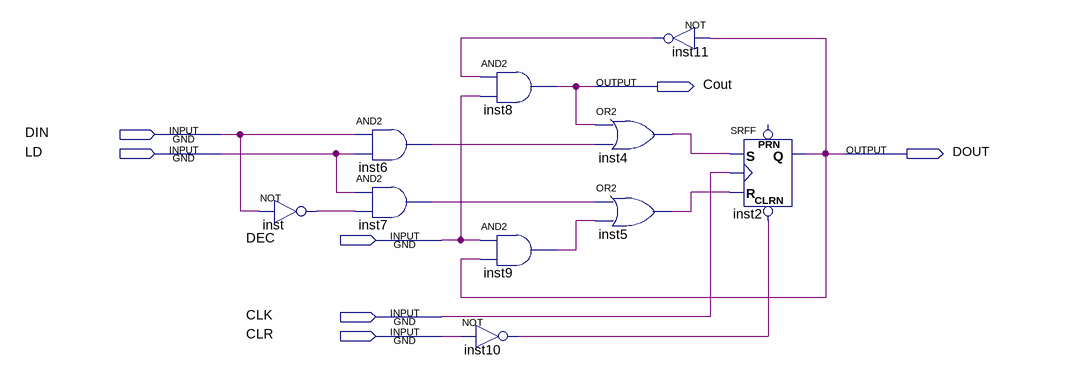
[diagram p0: schematic sheet]
// Quartus schematic reg1_ld_clr_dec.bdf as structural Verilog: 10 symbols, 7 pins
module reg1_ld_clr_dec (
  input  DIN,
  input  LD,
  input  DEC,
  input  CLK,
  input  CLR,
  output Cout,
  output DOUT
);

  wire inst4_out, inst5_out, inst6_out, inst7_out, inst9_out, inst10_out, inst11_out, inst_out;

  not inst (inst_out, DIN);
  and inst6 (inst6_out, DIN, LD);
  and inst7 (inst7_out, LD, inst_out);
  and inst8 (Cout, inst11_out, DEC);
  and inst9 (inst9_out, DEC, DOUT);
  not inst10 (inst10_out, CLR);
  or inst4 (inst4_out, Cout, inst6_out);
  or inst5 (inst5_out, inst7_out, inst9_out);
  not inst11 (inst11_out, DOUT);
  SRFF inst2 (.CLRN(inst10_out), .S(inst4_out), .R(inst5_out), .CLK(CLK), .Q(DOUT));  // open: PRN
endmodule
